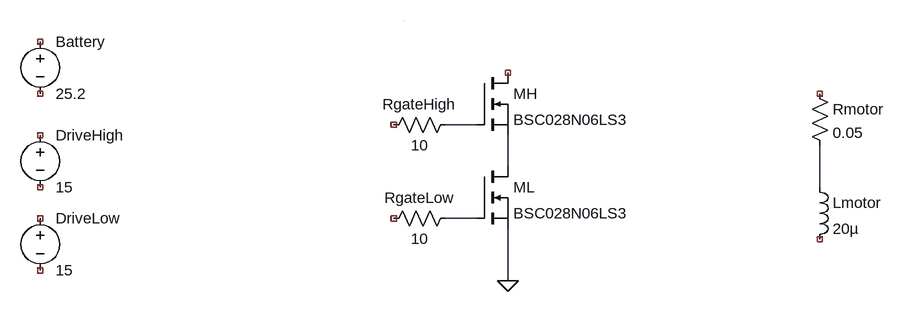
[diagram p0: schematic Draft1.asc]
Draft1.asc, the LTspice schematic file:
Version 4.1
SHEET 1 880 680
WIRE 112 160 64 160
WIRE 160 224 160 176
WIRE 640 256 640 192
WIRE 112 304 64 304
WIRE 160 400 160 320
WIRE 0 0 0 0
FLAG 160 400 0
SYMBOL nmos 112 80 R0
SYMATTR InstName MH
SYMATTR Value BSC028N06LS3
SYMBOL nmos 112 224 R0
SYMATTR InstName ML
SYMATTR Value BSC028N06LS3
SYMBOL voltage -560 16 R0
WINDOW 123 0 0 Left 0
WINDOW 39 0 0 Left 0
SYMATTR InstName Battery
SYMATTR Value 25.2
SYMBOL voltage -560 288 R0
WINDOW 123 0 0 Left 0
WINDOW 39 0 0 Left 0
SYMATTR InstName DriveLow
SYMATTR Value 15
SYMBOL voltage -560 160 R0
WINDOW 123 0 0 Left 0
WINDOW 39 0 0 Left 0
SYMATTR InstName DriveHigh
SYMATTR Value 15
SYMBOL res 624 96 R0
SYMATTR InstName Rmotor
SYMATTR Value 0.05
SYMBOL ind 624 240 R0
SYMATTR InstName Lmotor
SYMATTR Value 20µ
SYMBOL res 80 144 R90
WINDOW 0 0 56 VBottom 2
WINDOW 3 32 56 VTop 2
SYMATTR InstName RgateHigh
SYMATTR Value 10
SYMBOL res 80 288 R90
WINDOW 0 0 56 VBottom 2
WINDOW 3 32 56 VTop 2
SYMATTR InstName RgateLow
SYMATTR Value 10

The netlist it stands for:
* Draft1.asc
MH NC_01 N001 N002 N002 BSC028N06LS3
ML N002 N004 0 0 BSC028N06LS3
V§Battery NC_02 NC_03 25.2
V§DriveLow NC_04 NC_05 15
V§DriveHigh NC_06 NC_07 15
Rmotor NC_08 N003 0.05
Lmotor N003 NC_09 20µ
RgateHigh N001 NC_10 10
RgateLow N004 NC_11 10
.model NMOS NMOS
.model PMOS PMOS
.lib standard.mos
.backanno
.end